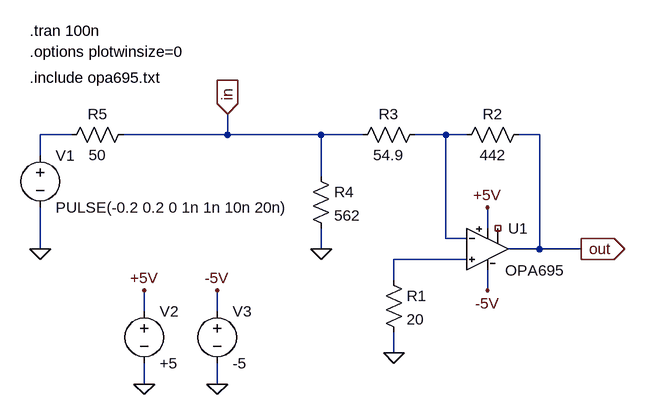
[diagram p0: schematic OPA695_test.asc]
OPA695_test.asc, the LTspice schematic file:
Version 4
SHEET 1 880 680
WIRE -528 48 -528 16
WIRE -528 192 -528 128
WIRE -480 16 -528 16
WIRE -368 288 -368 256
WIRE -368 400 -368 368
WIRE -256 288 -256 256
WIRE -256 400 -256 368
WIRE -240 16 -400 16
WIRE -240 16 -240 -16
WIRE -96 16 -240 16
WIRE -96 80 -96 16
WIRE -96 192 -96 160
WIRE -32 16 -96 16
WIRE 16 240 16 208
WIRE 16 352 16 320
WIRE 96 16 48 16
WIRE 96 176 96 16
WIRE 128 16 96 16
WIRE 128 176 96 176
WIRE 128 208 16 208
WIRE 160 160 160 128
WIRE 160 256 160 224
WIRE 240 16 208 16
WIRE 240 192 192 192
WIRE 240 192 240 16
WIRE 304 192 240 192
FLAG 160 128 +5V
FLAG 160 256 -5V
FLAG 16 352 0
FLAG -96 192 0
FLAG -528 192 0
FLAG -256 400 0
FLAG -368 400 0
FLAG -368 256 +5V
FLAG -256 256 -5V
FLAG 304 192 out
IOPIN 304 192 Out
FLAG -240 -16 in
IOPIN -240 -16 In
SYMBOL res 0 224 R0
SYMATTR InstName R1
SYMATTR Value 20
SYMBOL res 112 32 R270
WINDOW 0 32 56 VTop 0
WINDOW 3 0 56 VBottom 0
SYMATTR InstName R2
SYMATTR Value 442
SYMBOL res -48 32 R270
WINDOW 0 32 56 VTop 0
WINDOW 3 0 56 VBottom 0
SYMATTR InstName R3
SYMATTR Value 54.9
SYMBOL res -112 64 R0
SYMATTR InstName R4
SYMATTR Value 562
SYMBOL voltage -528 32 R0
WINDOW 123 0 0 Left 0
WINDOW 39 0 0 Left 0
SYMATTR InstName V1
SYMATTR Value PULSE(-0.2 0.2 0 1n 1n 10n 20n)
SYMBOL res -496 32 R270
WINDOW 0 32 56 VTop 0
WINDOW 3 0 56 VBottom 0
SYMATTR InstName R5
SYMATTR Value 50
SYMBOL voltage -368 272 R0
SYMATTR InstName V2
SYMATTR Value +5
SYMBOL voltage -256 272 R0
SYMATTR InstName V3
SYMATTR Value -5
SYMBOL xopamp_c1 160 128 R0
SYMATTR InstName U1
SYMATTR Value OPA695
TEXT -544 -144 Left 0 !.tran 100n
TEXT -544 -112 Left 0 !.options plotwinsize=0
TEXT -544 -72 Left 0 !.include opa695.txt

The netlist it stands for:
* OPA695_test.asc
R1 N002 0 20
R2 N003 out 442
R3 in N003 54.9
R4 in 0 562
V1 N001 0 PULSE(-0.2 0.2 0 1n 1n 10n 20n)
R5 N001 in 50
V2 +5V 0 +5
V3 -5V 0 -5
XU1 N002 N003 +5V -5V out NC_01 OPA695  ; pins In+ In- V+ V- OUT COMP
.tran 100n
.options plotwinsize=0
.include opa695.txt
.backanno
.end